# Altium schematic sheet Load_Cell_Acquisition.SchDoc
size A3; Organization: Altium Limited; Address1: L3, 12a Rodborough Rd; Address2: Frenchs Forest; Address3: NSW; Address4: Australia 2086; DocumentNumber: 2; SheetNumber: 2; SheetTotal: 8
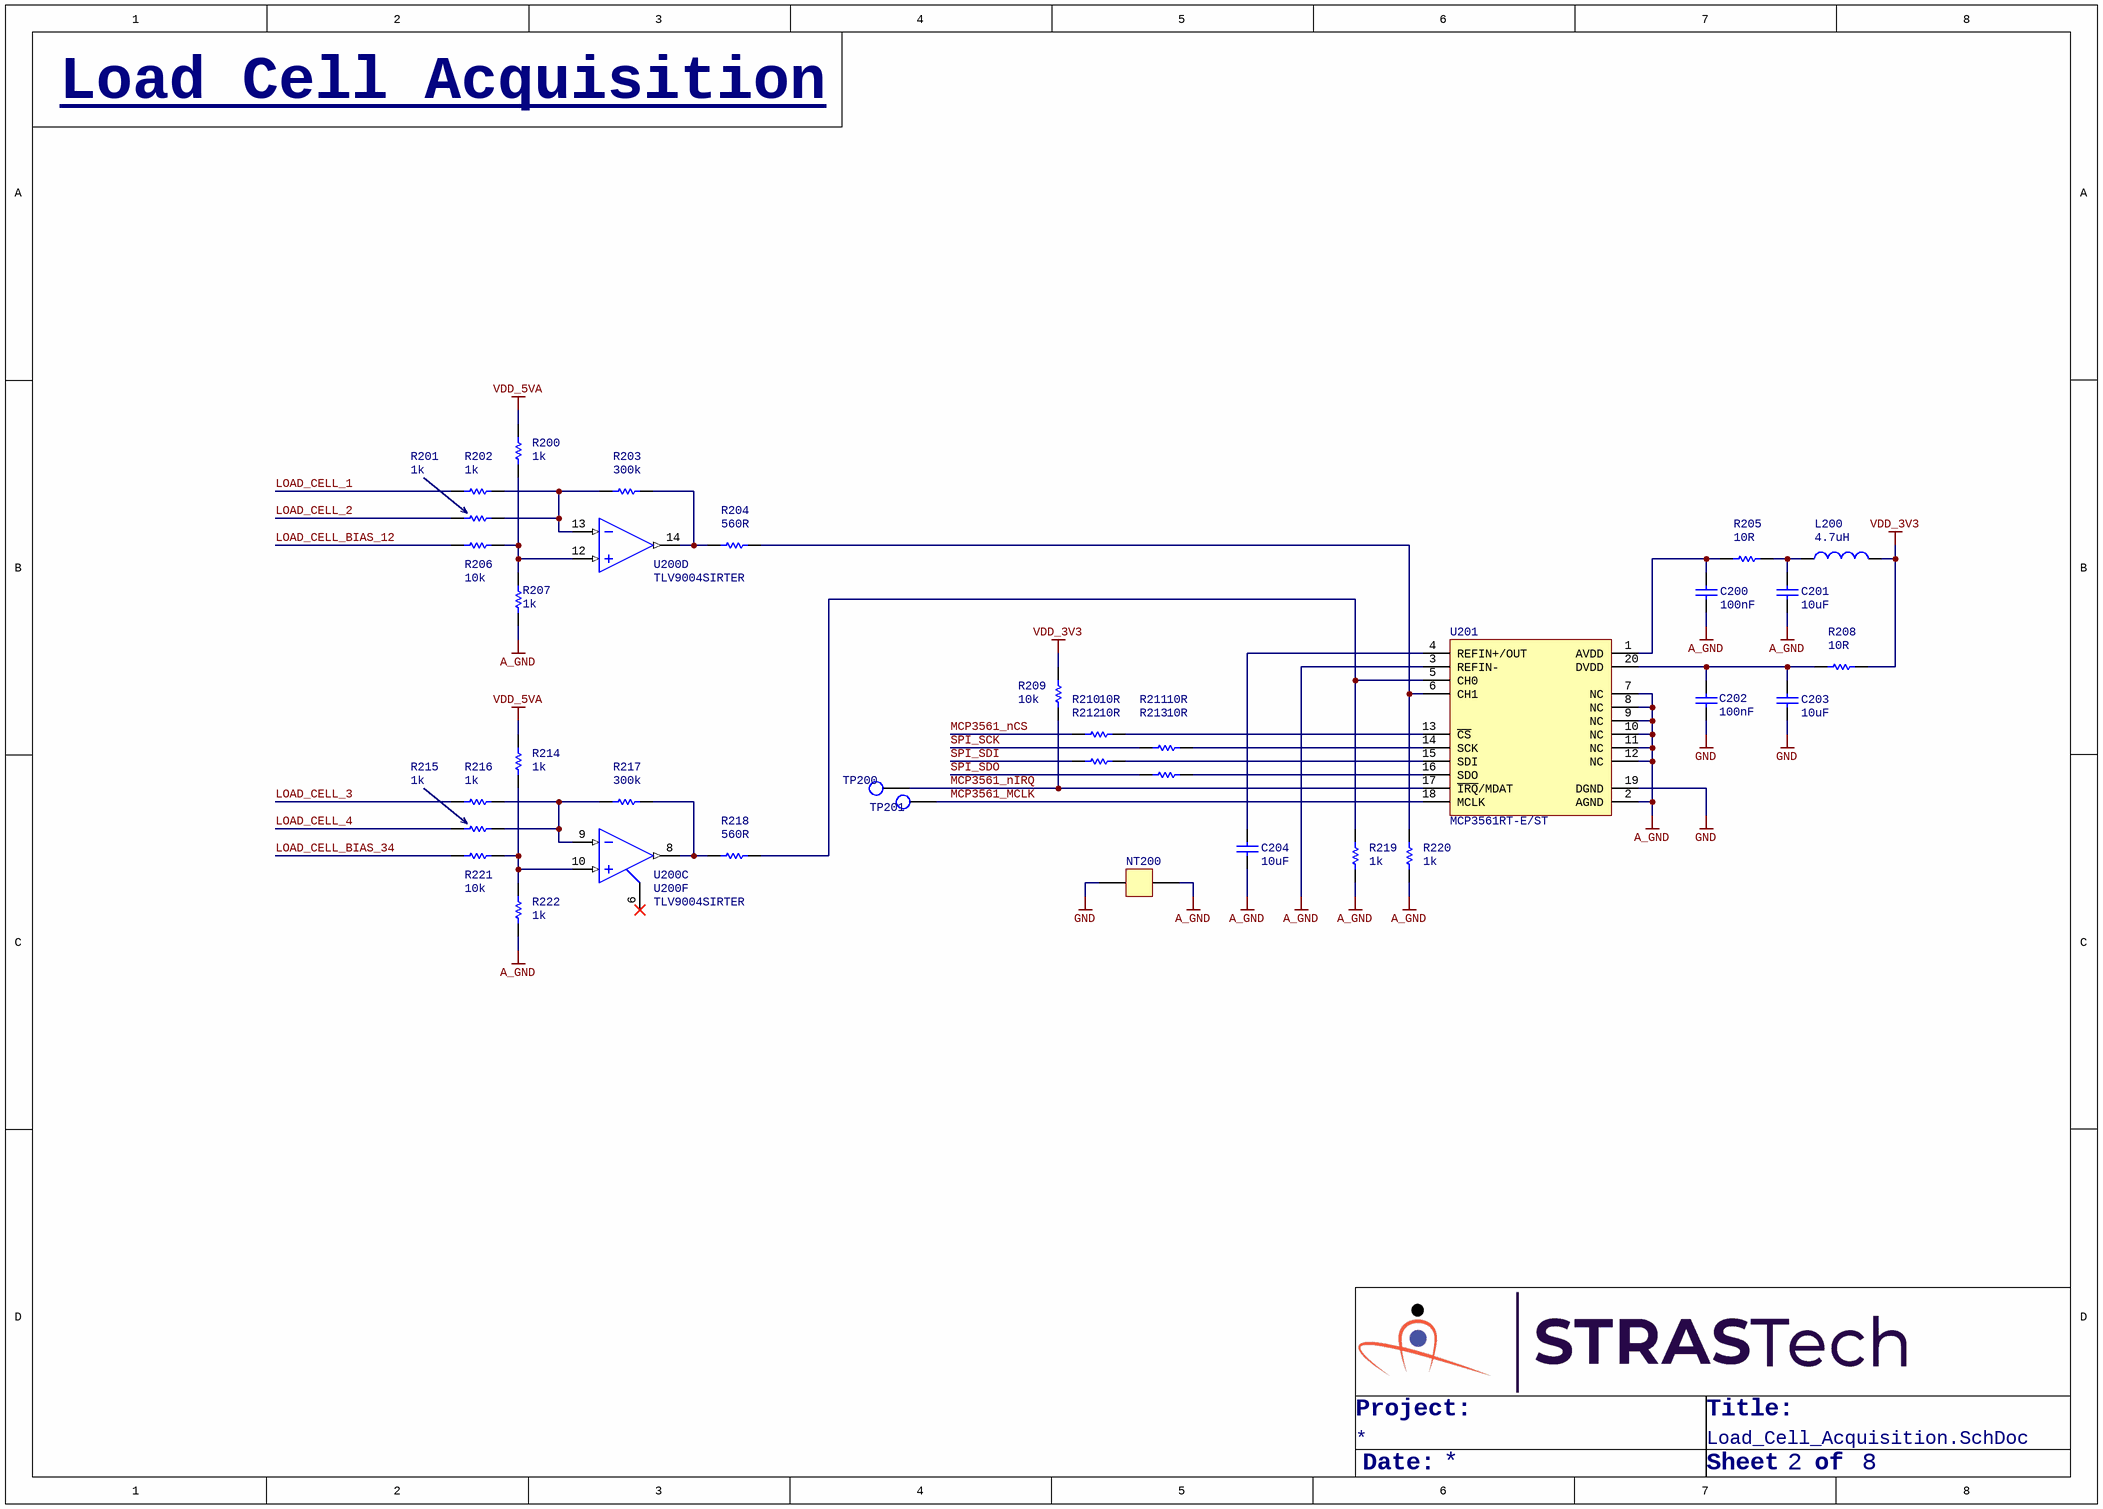
[diagram p0: Load_Cell_Acquisition.SchDoc]

## Parts
C200  100nF  [Cap,SMD,0402]
C201  10uF  [Cap,SMD,0402]
C202  100nF  [Cap,SMD,0402]
C203  10uF  [Cap,SMD,0402]
C204  10uF  [Cap,SMD,0402]
L200  4.7uH  [IND,0805]
NT200  Net Tie  [Net Tie,20x60mil]  (value not drawn)  (net tie, no BOM)
R200  1k  [RES,0402]
R201  1k  [RES,0402]
R202  1k  [RES,0402]
R203  300k  [RES,0402]
R204  560R  [RES,0402]
R205  10R  [RES,0402]
R206  10k  [RES,0402]
R207  1k  [RES,0402]
R208  10R  [RES,0402]
R209  10k  [RES,0402]
R210  10R  [RES,0402]
R211  10R  [RES,0402]
R212  10R  [RES,0402]
R213  10R  [RES,0402]
R214  1k  [RES,0402]
R215  1k  [RES,0402]
R216  1k  [RES,0402]
R217  300k  [RES,0402]
R218  560R  [RES,0402]
R219  1k  [RES,0402]
R220  1k  [RES,0402]
R221  10k  [RES,0402]
R222  1k  [RES,0402]
TP200  TESTPOINT  [testpoint,smd,round,1mm]  (value not drawn)
TP201  TESTPOINT  [testpoint,smd,round,1mm]  (value not drawn)
U200  TLV9004SIRTER  [IC,QFN-16,3x3]  (parts C,D,F of 8)
U201  MCP3561RT-E/ST  [IC,TSSOP-20,W4.4]

## Nets
A_GND: C200.1 C201.2 C204.1 NT200.2 R207.1 R219.2 R220.2 R222.1 U201.2(AGND) U201.3(REFIN-) U201.7(NC) U201.8(NC) U201.9(NC) U201.10(NC) U201.11(NC) U201.12(NC)
GND: C202.1 C203.2 NT200.1 U201.19(DGND)
VDD_3V3: L200.2 R208.2 R209.2
VDD_5VA: R200.2 R214.2
LOAD_CELL_1: R202.2
LOAD_CELL_2: R201.2
LOAD_CELL_3: R216.2
LOAD_CELL_4: R215.2
LOAD_CELL_BIAS_12: R206.1
LOAD_CELL_BIAS_34: R221.1
MCP3561_MCLK: TP201.1(TP) U201.18(MCLK)
MCP3561_nCS: R210.1
MCP3561_nIRQ: R209.1 TP200.1(TP) U201.17(~{IRQ}/MDAT)
SPI_SCK: R211.1
SPI_SDI: R212.1
SPI_SDO: R213.1
NetC200_2: C200.2 R205.1 U201.1(AVDD)
NetC201_1: C201.1 L200.1 R205.2
NetC202_2: C202.2 C203.1 R208.1 U201.20(DVDD)
NetC204_2: C204.2 U201.4(REFIN+/OUT)
NetR200_1: R200.1 R206.2 R207.2 U200.12(IN4+)
NetR201_1: R201.1 R202.1 R203.2 U200.13(IN4-)
NetR203_1: R203.1 R204.2 U200.14(OUT4)
NetR204_1: R204.1 R220.1 U201.6(CH1)
NetR210_2: R210.2 U201.13(~{CS})
NetR211_2: R211.2 U201.14(SCK)
NetR212_2: R212.2 U201.15(SDI)
NetR213_2: R213.2 U201.16(SDO)
NetR214_1: R214.1 R221.2 R222.2 U200.10(IN3+)
NetR215_1: R215.1 R216.1 R217.2 U200.9(IN3-)
NetR217_1: R217.1 R218.2 U200.8(OUT3)
NetR218_1: R218.1 R219.1 U201.5(CH0)

Not connected (* = marked no-connect by the designer): U200 6(~{SHDN}12)*

## Notes on the sheet
- Load Cell Acquisition
- Project:
- Title:
- Date:
- Sheet
- of
- Title
- Size:
- A3
- Revision:
- Design By:

## Library data of the parts
C200 C202 = CAP,Cer,100nF,25VDC,X7R,0402: 0.1µF ±10% 25V Ceramic Capacitor X7R 0402 (1005 Metric); Vendor Part Number: 490-14603-1-ND; Manufacturer: Murata Electronics; Manufacturer Part Number: GRM155R71E104KE14J; Vendor: Digikey; HelpURL: https://search.murata.co.jp/Ceramy/image/img/A01X/G101/ENG/GRM155R71E104KE14-01.pdf; CreatedBy: Judd Foster
C201 C203 C204 = CAP,Cer,10uF,10VDC,X5R,0402: 10 µF ±20% 10V Ceramic Capacitor X5R 0402 (1005 Metric); Vendor Part Number: 1276-1450-1-ND; Manufacturer: Samsung Electro-Mechanics; Manufacturer Part Number: CL05A106MP5NUNC; Vendor: Digikey; HelpURL: https://media.digikey.com/pdf/Data%20Sheets/Samsung%20PDFs/CL05A106MP5NUNC_Spec.pdf; CreatedBy: Judd Foster
L200 = IND,4.7uH,80mA,Multilayer,0805: 4.7 µH Shielded Multilayer Inductor 80 mA 300mOhm 0805 (2012 Metric); Vendor Part Number: 445-3169-1-ND; Manufacturer: TDK Corporation; Manufacturer Part Number: MLZ2012E4R7MT000; Vendor: Digikey; HelpURL: https://product.tdk.com/en/system/files?file=dam/doc/product/inductor/inductor/smd/catalog/inductor_commercial_decoupling_mlz2012_en.pdf; CreatedBy: Judd Foster
R200-R202 R207 R214-R216 R219 R220 R222 = RES,1k,5%,0.063W,0402: 1 kOhms ±5% 0.063W, 1/16W Chip Resistor 0402 (1005 Metric) Automotive AEC-Q200 Thick Film; Vendor Part Number: RMCF0402JT1K00CT-ND; Manufacturer: Stackpole Electronics Inc; Manufacturer Part Number: RMCF0402JT1K00; Vendor: DIgikey; HelpURL: https://www.seielect.com/catalog/sei-rmcf_rmcp.pdf; CreatedBy: Judd Foster
R203 R217 = RES,300k,1%,0.063W,0402: 300 kOhms ±1% 0.063W, 1/16W Chip Resistor 0402 (1005 Metric) Automotive AEC-Q200 Thick Film; Manufacturer: Stackpole Electronics Inc; Manufacturer Part Number: RMCF0402FT300K; Vendor Part Number: RMCF0402FT300KCT-ND; Vendor: Digikey; CreatedBy: Judd Foster; HelpURL: https://www.seielect.com/catalog/sei-rmcf_rmcp.pdf
R204 R218 = RES,560R,1%,0.063W,0402: 560 Ohms ±1% 0.063W, 1/16W Chip Resistor 0402 (1005 Metric) Automotive AEC-Q200, Moisture Resistant Thick Film; Manufacturer: TE Connectivity Passive Product; Manufacturer Part Number: CRGCQ0402F560R; Vendor Part Number: A129624CT-ND; Vendor: Digikey; CreatedBy: Judd Foster; HelpURL: https://www.te.com/commerce/DocumentDelivery/DDEController?Action=srchrtrv&DocNm=1773204-3&DocType=DS&DocLang=English
R205 R208 R210-R213 = RES,10R,1%,0.063W,0402: 10 Ohms ±1% 0.063W, 1/16W Chip Resistor 0402 (1005 Metric) Automotive AEC-Q200 Thick Film; Manufacturer: Panasonic Electronic Components; Manufacturer Part Number: ERJ-2RKF10R0X; Vendor Part Number: P10.0LCT-ND; Vendor: Digikey; CreatedBy: Judd Foster; HelpURL: https://industrial.panasonic.com/cdbs/www-data/pdf/RDA0000/AOA0000C304.pdf
R206 R209 R221 = RES,10k,5%,0.063W,0402: 10 kOhms ±5% 0.063W, 1/16W Chip Resistor 0402 (1005 Metric) Automotive AEC-Q200 Thick Film; Vendor Part Number: RMCF0402JT10K0CT-ND; Manufacturer: Stackpole Electronics Inc; Manufacturer Part Number: RMCF0402JT10K0; Vendor: DIgikey; HelpURL: https://www.seielect.com/catalog/sei-rmcf_rmcp.pdf; CreatedBy: Judd Foster
TP200 TP201 = TESTPOINT: PCB Testpoint; CreatedBy: Judd Foster; HelpURL: N/A; Manufacturer: N/A; Manufacturer Part Number: N/A; Vendor: N/A; Vendor Part Number: N/A
U200 = TLV9004SIRTER: General Purpose Amplifier 4 Circuit Rail-to-Rail 16-WQFN (3x3); Manufacturer: Texas Instruments; Vendor Part Number: 296-51829-1-ND; Vendor: Digikey; CreatedBy: Judd Foster; HelpURL: https://www.ti.com/general/docs/suppproductinfo.tsp?distId=10&gotoUrl=https%3A%2F%2Fwww.ti.com%2Flit%2Fgpn%2Ftlv9004; Manufacturer Part Number: TLV9004SIRTER
U201 = MCP3561RT-E/ST: 24 Bit Analog to Digital Converter 1 Input 1 Sigma-Delta 20-TSSOP; Vendor Part Number: 150-MCP3561RT-E/STCT-ND; Manufacturer: Microchip Technology; Vendor: Digikey; Manufacturer Part Number: MCP3561RT-E/ST; HelpURL: https://ww1.microchip.com/downloads/en/DeviceDoc/MCP3561.2.4R-Data-Sheet-DS200006391A.pdf; CreatedBy: Judd Foster
NT200 = Net Tie: CreatedBy: Makan Mousavi; HelpURL: N/A; Manufacturer: N/A; Manufacturer Part Number: N/A; Vendor: N/A; Vendor Part Number: N/A